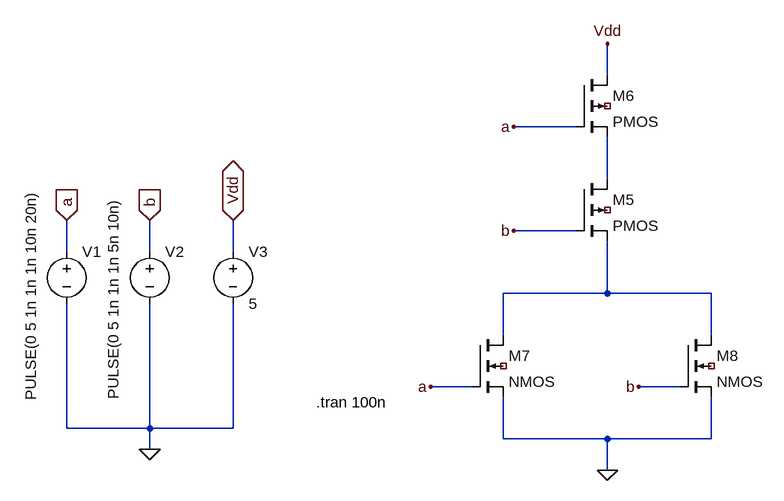
[diagram p0: schematic NOR.asc]
NOR.asc, the LTspice schematic file:
Version 4
SHEET 1 1772 784
WIRE 880 -16 880 -64
WIRE 832 64 736 64
WIRE 880 144 880 80
WIRE 832 224 736 224
WIRE 48 256 48 208
WIRE 176 256 176 208
WIRE 304 256 304 208
WIRE 880 320 880 240
WIRE 880 320 720 320
WIRE 1040 320 880 320
WIRE 720 384 720 320
WIRE 1040 384 1040 320
WIRE 672 464 608 464
WIRE 992 464 928 464
WIRE 48 528 48 336
WIRE 176 528 176 336
WIRE 176 528 48 528
WIRE 304 528 304 336
WIRE 304 528 176 528
WIRE 720 544 720 480
WIRE 880 544 720 544
WIRE 1040 544 1040 480
WIRE 1040 544 880 544
WIRE 176 560 176 528
WIRE 880 592 880 544
FLAG 176 560 0
FLAG 48 208 a
IOPIN 48 208 In
FLAG 176 208 b
IOPIN 176 208 In
FLAG 304 208 Vdd
IOPIN 304 208 BiDir
FLAG 880 592 0
FLAG 736 64 a
FLAG 608 464 a
FLAG 736 224 b
FLAG 928 464 b
FLAG 880 -64 Vdd
SYMBOL voltage 48 240 R0
WINDOW 3 -55 -79 VRight 2
SYMATTR InstName V1
SYMATTR Value PULSE(0 5 1n 1n 1n 10n 20n)
SYMBOL voltage 176 240 R0
WINDOW 3 -56 -67 VRight 2
SYMATTR InstName V2
SYMATTR Value PULSE(0 5 1n 1n 1n 5n 10n)
SYMBOL voltage 304 240 R0
SYMATTR InstName V3
SYMATTR Value 5
SYMBOL pmos4 832 144 R0
SYMATTR InstName M5
SYMBOL pmos4 832 -16 R0
SYMATTR InstName M6
SYMBOL nmos4 672 384 R0
SYMATTR InstName M7
SYMBOL nmos4 992 384 R0
SYMATTR InstName M8
TEXT 432 488 Left 2 !.tran 100n

The netlist it stands for:
* NOR.asc
V1 a 0 PULSE(0 5 1n 1n 1n 10n 20n)
V2 b 0 PULSE(0 5 1n 1n 1n 5n 10n)
V3 Vdd 0 5
M5 N001 b N002 NC_01 PMOS
M6 Vdd a N001 NC_02 PMOS
M7 N002 a 0 NC_03 NMOS
M8 N002 b 0 NC_04 NMOS
.model NMOS NMOS
.model PMOS PMOS
.lib standard.mos
.tran 100n
.backanno
.end